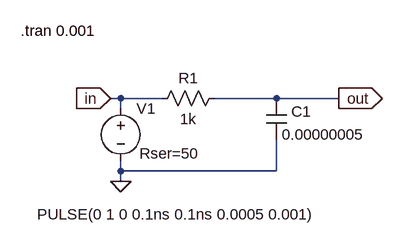
[diagram p0: schematic exp2.asc]
exp2.asc, the LTspice schematic file:
Version 4
SHEET 1 880 680
WIRE 288 -192 272 -192
WIRE 352 -192 288 -192
WIRE 528 -192 432 -192
WIRE 624 -192 528 -192
WIRE 288 -176 288 -192
WIRE 288 -80 288 -96
WIRE 528 -80 528 -128
WIRE 528 -80 288 -80
WIRE 288 -64 288 -80
FLAG 288 -64 0
FLAG 272 -192 in
IOPIN 272 -192 In
FLAG 624 -192 out
IOPIN 624 -192 Out
SYMBOL cap 512 -192 R0
WINDOW 0 39 20 Left 2
SYMATTR InstName C1
SYMATTR Value 0.00000005
SYMBOL res 448 -208 R90
WINDOW 0 0 56 VBottom 2
WINDOW 3 32 56 VTop 2
SYMATTR InstName R1
SYMATTR Value 1k
SYMBOL voltage 288 -192 R0
WINDOW 3 -129 179 Left 2
WINDOW 123 0 0 Left 0
WINDOW 39 29 85 Left 2
SYMATTR InstName V1
SYMATTR Value PULSE(0 1 0 0.1ns 0.1ns 0.0005 0.001)
SYMATTR SpiceLine Rser=50
TEXT 134 -296 Left 2 !.tran 0.001

The netlist it stands for:
* exp2.asc
C1 out 0 0.00000005
R1 out in 1k
V1 in 0 PULSE(0 1 0 0.1ns 0.1ns 0.0005 0.001) Rser=50
.tran 0.001
.backanno
.end